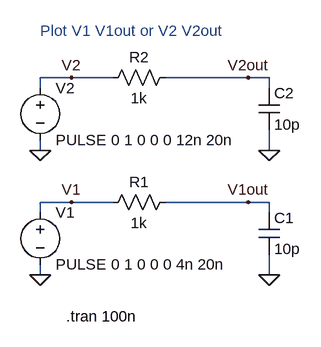
[diagram p0: schematic Fig18_26.asc]
Fig18_26.asc, the LTspice schematic file:
Version 4
SHEET 1 1048 680
WIRE 0 48 0 32
WIRE 0 144 0 128
WIRE 0 240 0 224
WIRE 0 336 0 320
WIRE 48 32 0 32
WIRE 48 224 0 224
WIRE 112 32 48 32
WIRE 112 224 48 224
WIRE 320 32 192 32
WIRE 320 224 192 224
WIRE 352 32 320 32
WIRE 352 48 352 32
WIRE 352 144 352 112
WIRE 352 224 320 224
WIRE 352 240 352 224
WIRE 352 336 352 304
FLAG 0 336 0
FLAG 352 336 0
FLAG 320 224 V1out
FLAG 48 224 V1
FLAG 0 144 0
FLAG 352 144 0
FLAG 320 32 V2out
FLAG 48 32 V2
SYMBOL voltage 0 224 R0
WINDOW 123 0 0 Left 0
WINDOW 39 0 0 Left 0
SYMATTR InstName V1
SYMATTR Value PULSE 0 1 0 0 0 4n 20n
SYMBOL res 96 240 R270
WINDOW 0 32 56 VTop 0
WINDOW 3 0 56 VBottom 0
SYMATTR InstName R1
SYMATTR Value 1k
SYMBOL cap 336 240 R0
SYMATTR InstName C1
SYMATTR Value 10p
SYMBOL voltage 0 32 R0
WINDOW 123 0 0 Left 0
WINDOW 39 0 0 Left 0
SYMATTR InstName V2
SYMATTR Value PULSE 0 1 0 0 0 12n 20n
SYMBOL res 96 48 R270
WINDOW 0 32 56 VTop 0
WINDOW 3 0 56 VBottom 0
SYMATTR InstName R2
SYMATTR Value 1k
SYMBOL cap 336 48 R0
SYMATTR InstName C2
SYMATTR Value 10p
TEXT 40 400 Left 0 !.tran 100n
TEXT 0 -40 Left 0 ;Plot V1 V1out or V2 V2out

The netlist it stands for:
* Fig18_26.asc
V1 V1 0 PULSE 0 1 0 0 0 4n 20n
R1 V1 V1out 1k
C1 V1out 0 10p
V2 V2 0 PULSE 0 1 0 0 0 12n 20n
R2 V2 V2out 1k
C2 V2out 0 10p
.tran 100n
* Plot V1 V1out or V2 V2out
.backanno
.end